# EAGLE schematic trig3_board_de0-nano_rack (EAGLE 9.6.2)
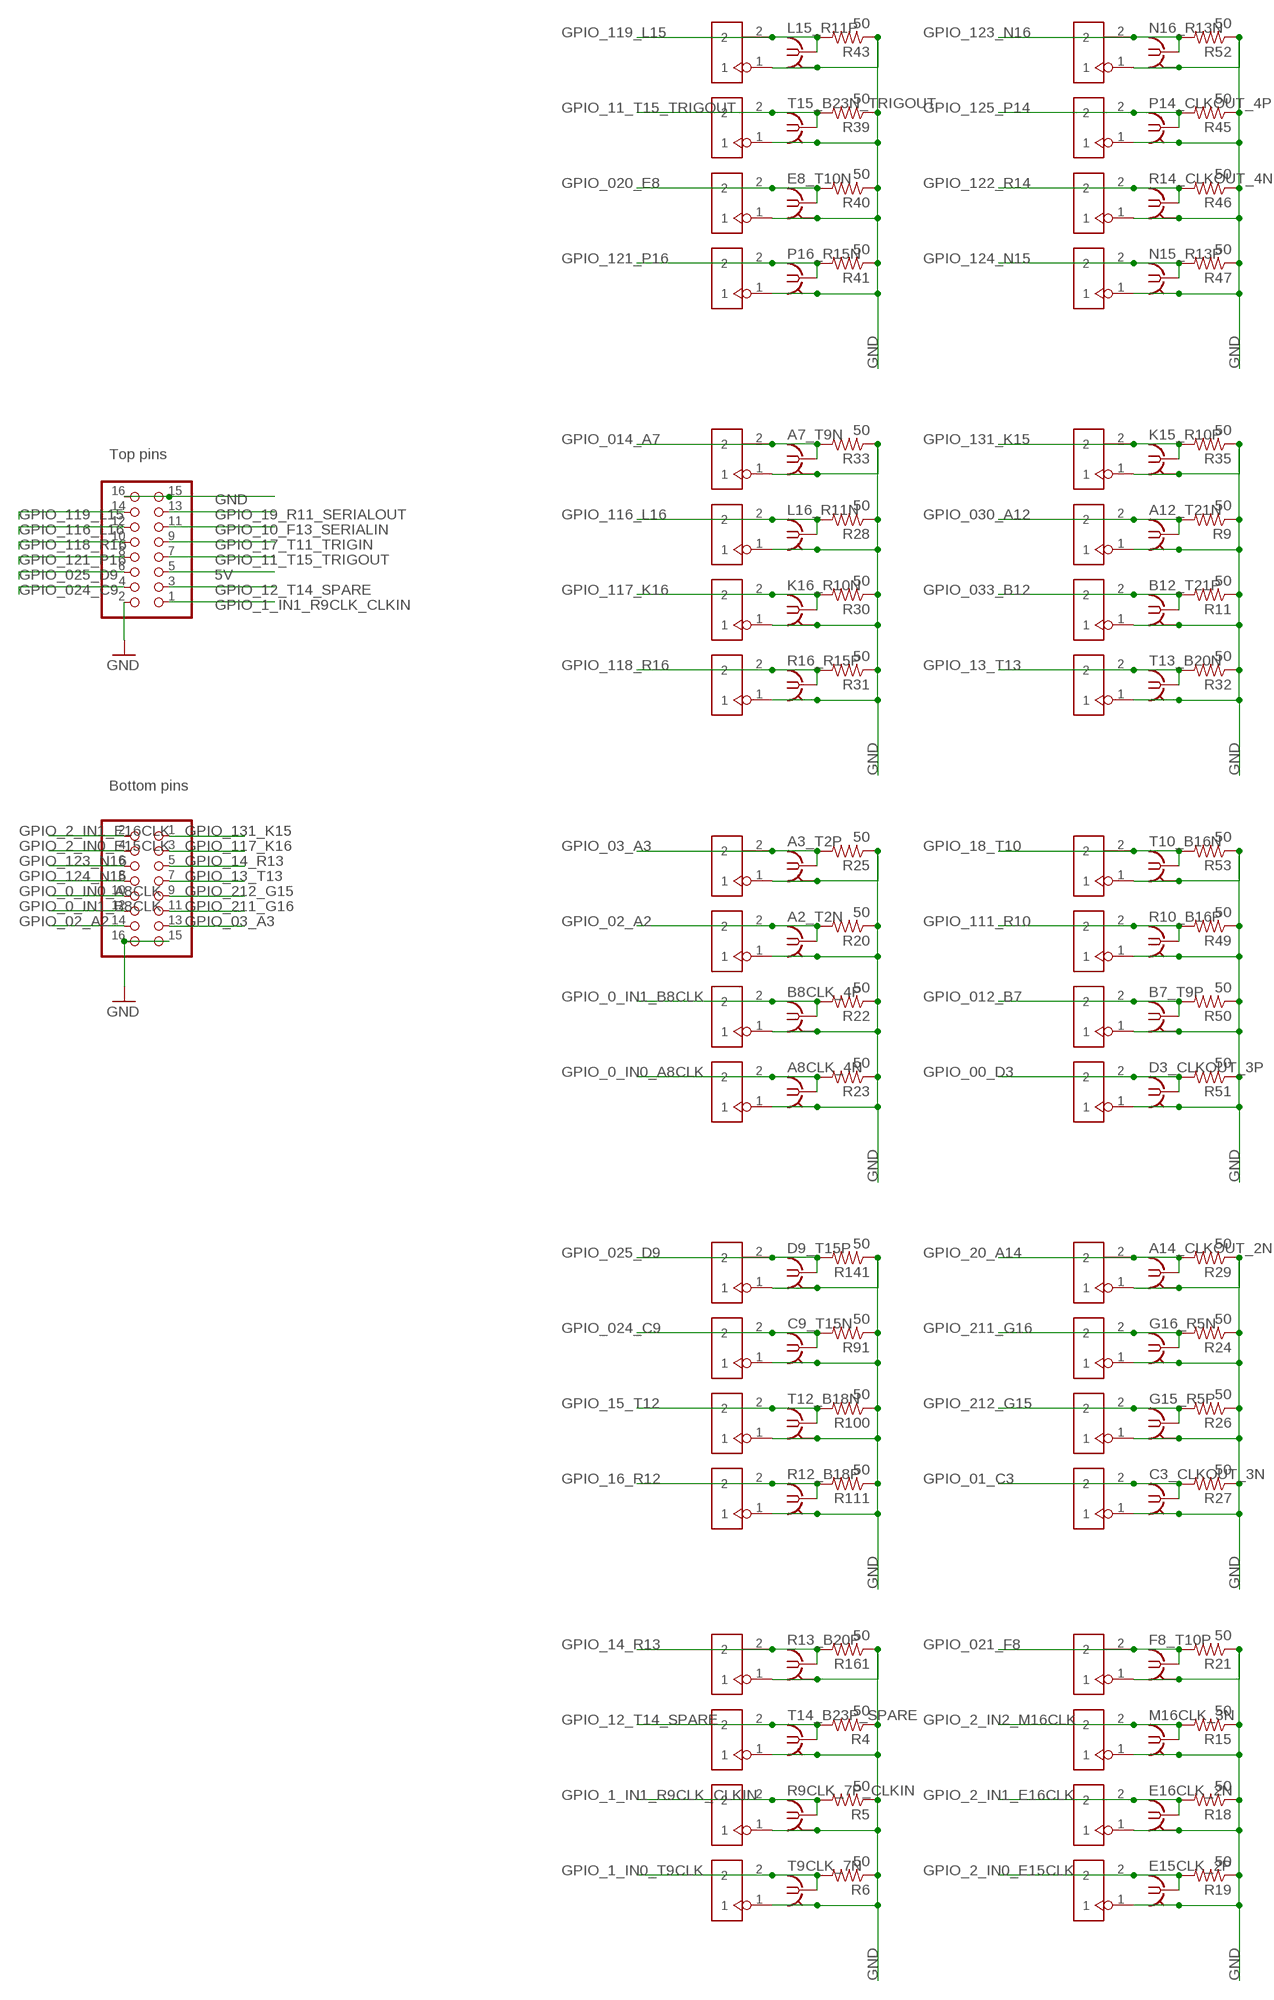
[diagram p0: schematic, sheet 1, part 1 of 3]
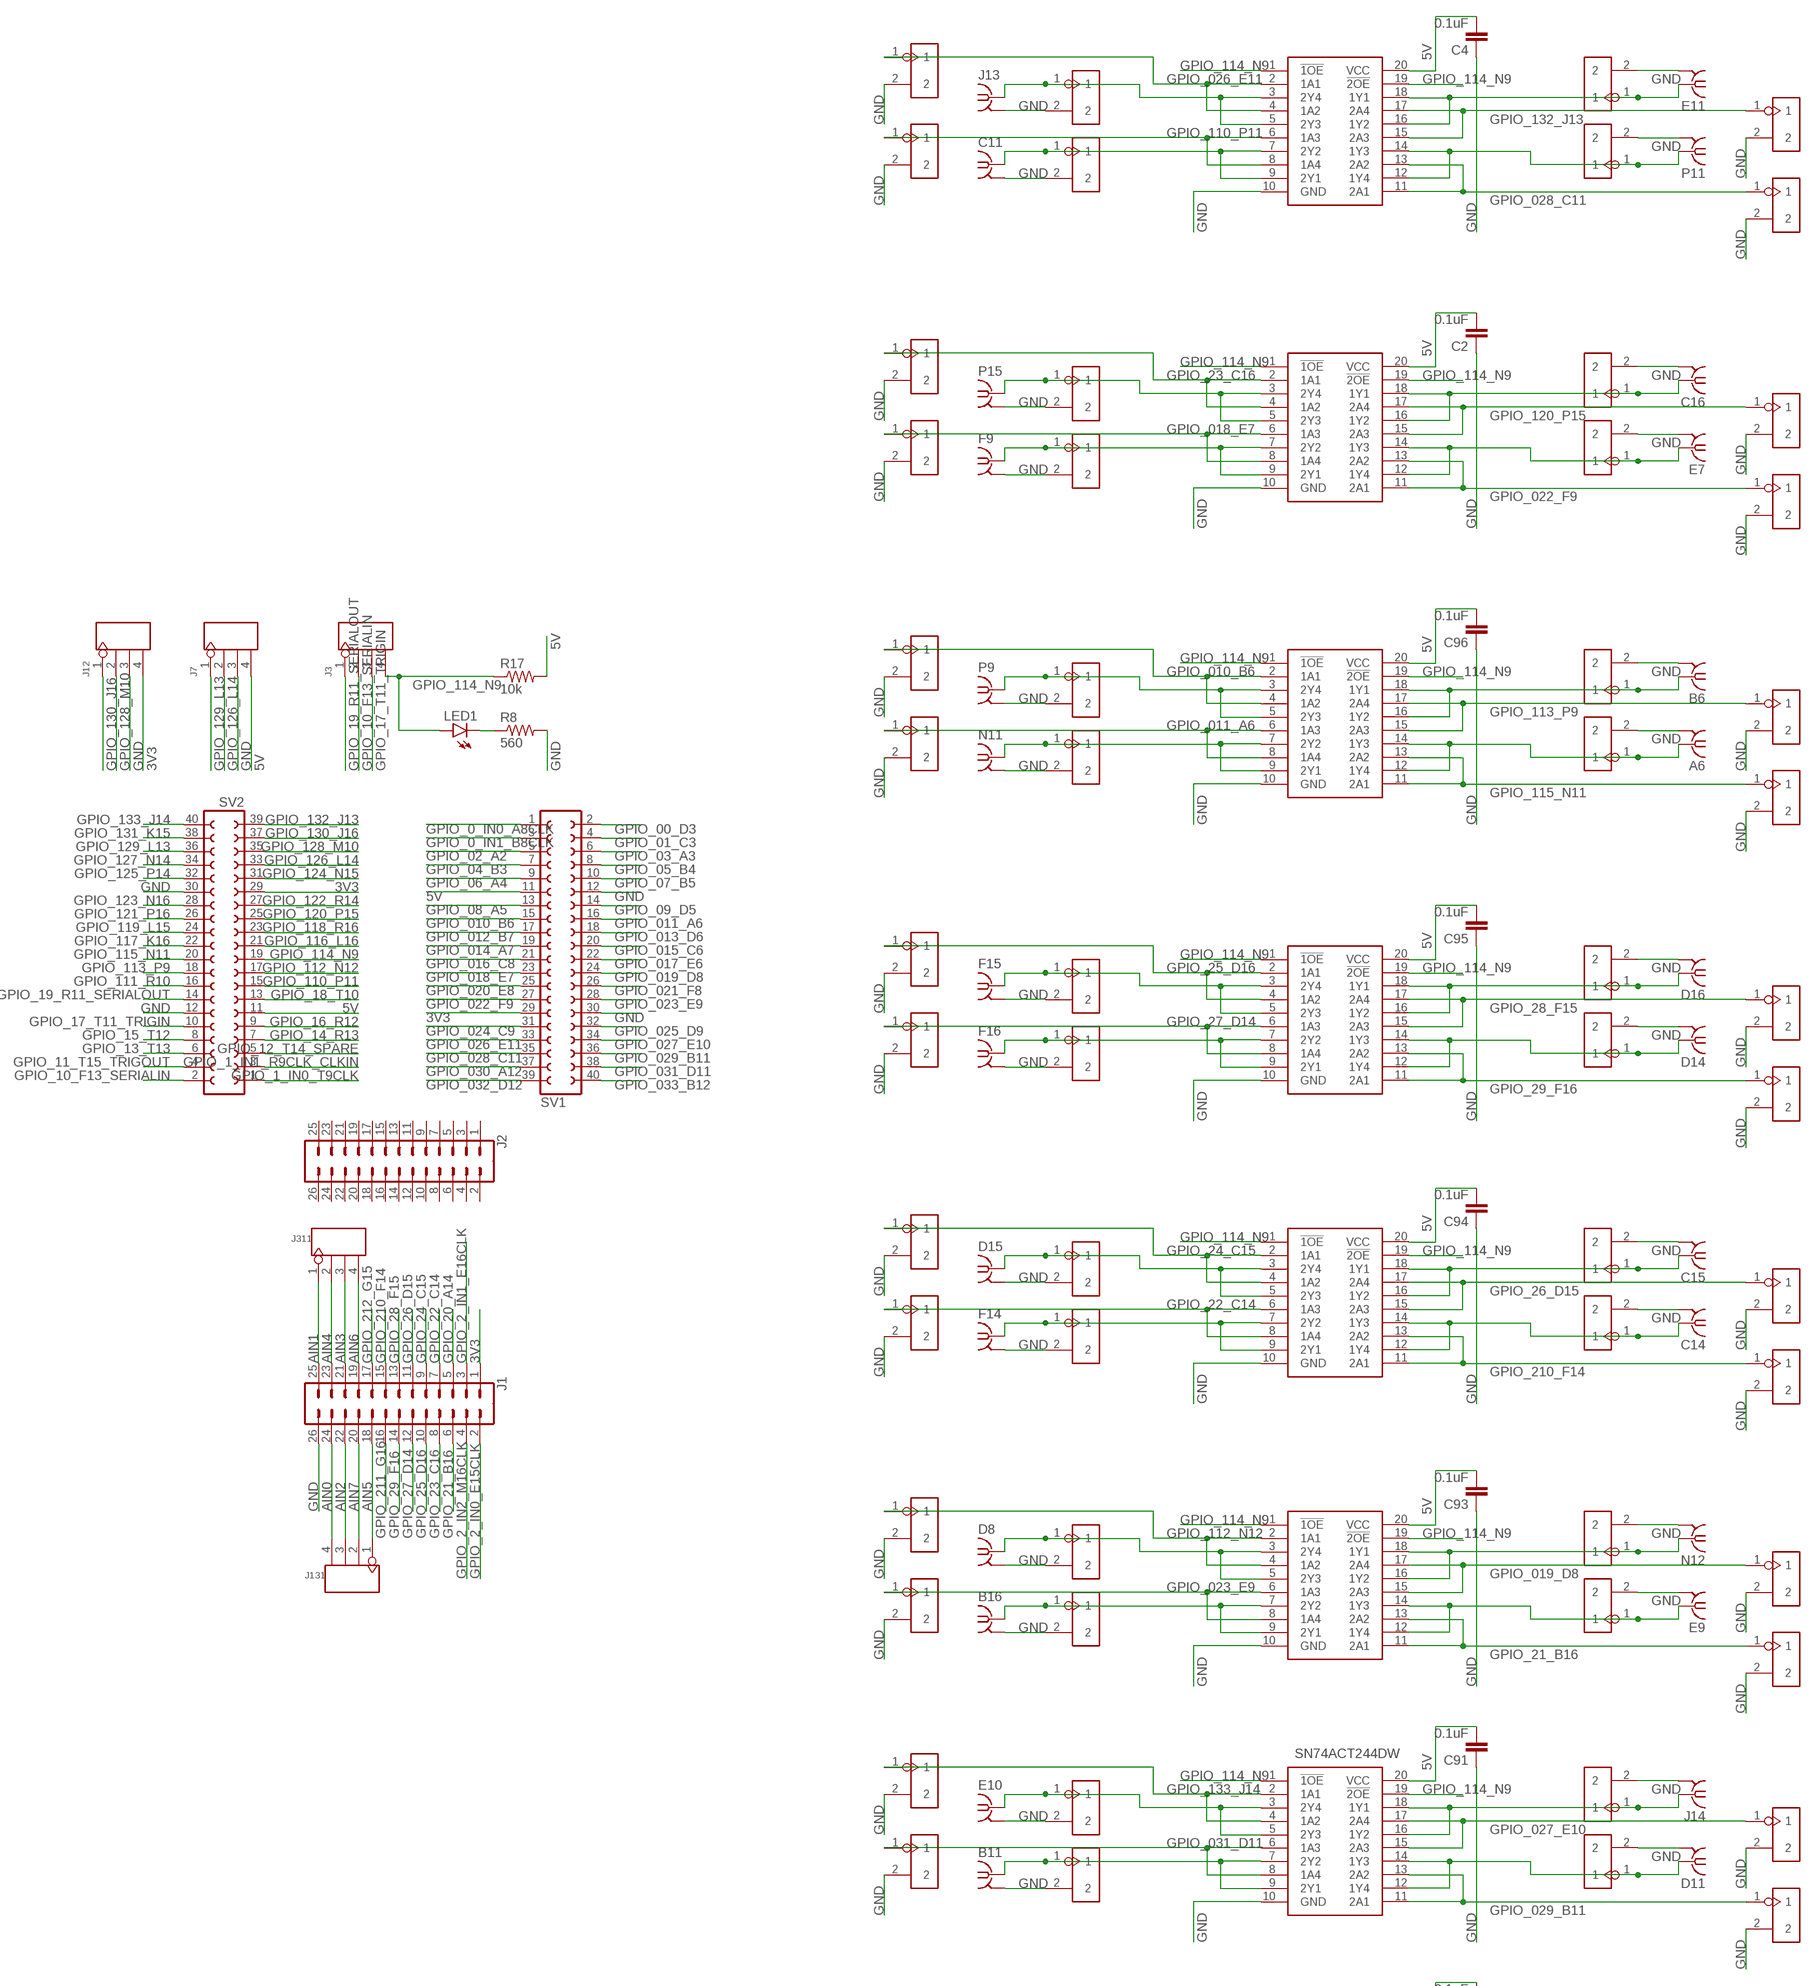
[diagram p1: schematic, sheet 1, part 2 of 3]
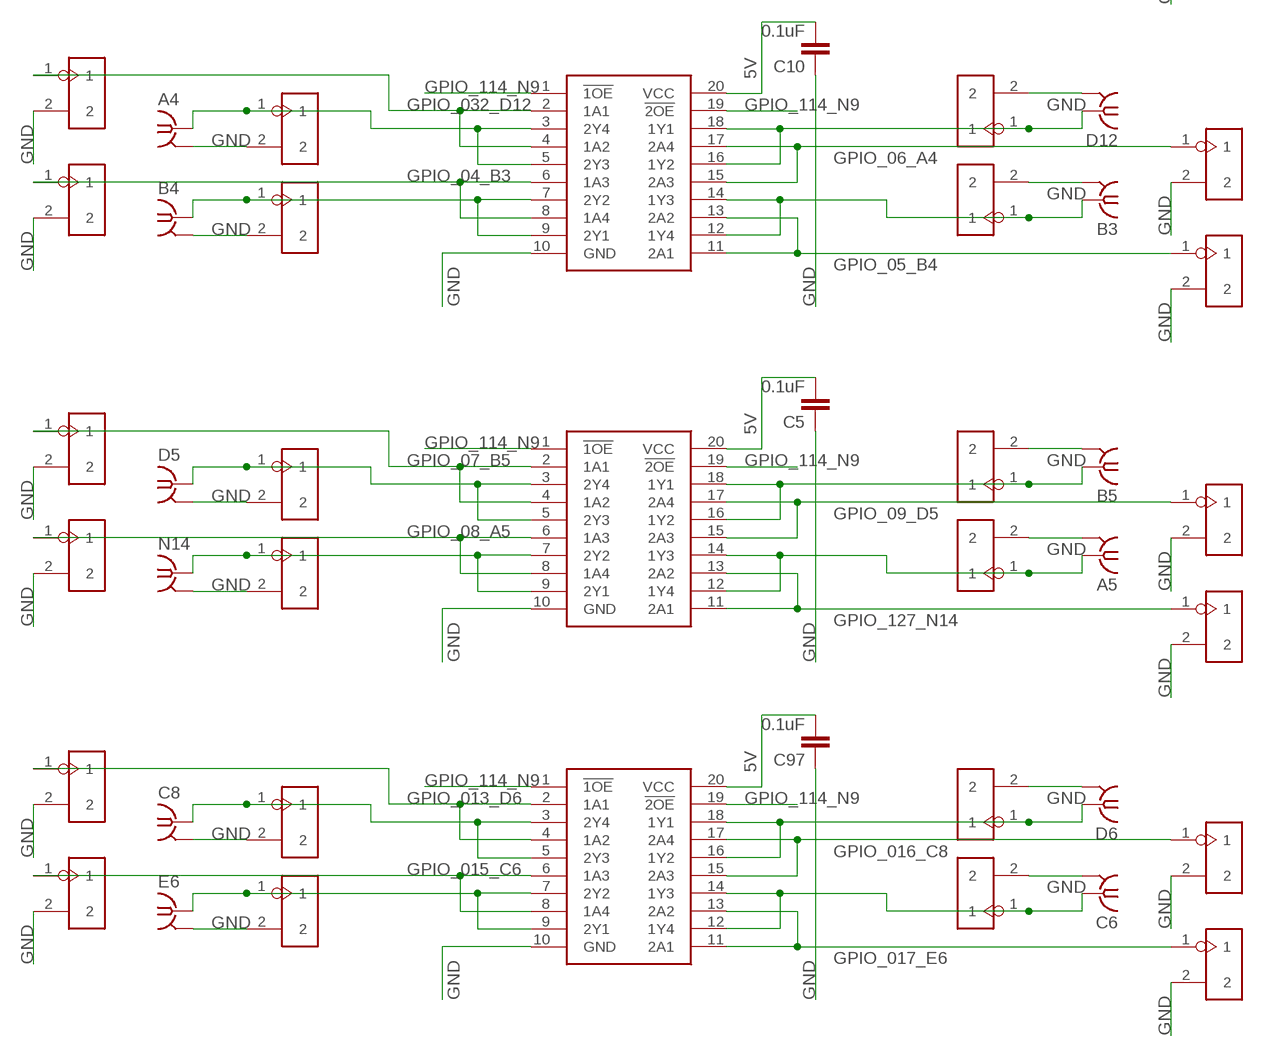
[diagram p2: schematic, sheet 1, part 3 of 3]

## Parts
A2_T2N  BU-SMB-V  [BU-SMB-V]
A3_T2P  BU-SMB-V  [BU-SMB-V]
A4  BU-SMB-V  [BU-SMB-V]
A5  BU-SMB-V  [BU-SMB-V]
A6  BU-SMB-V  [BU-SMB-V]
A7_T9N  BU-SMB-V  [BU-SMB-V]
A8CLK_4N  BU-SMB-V  [BU-SMB-V]
A12_T21N  BU-SMB-V  [BU-SMB-V]
A14_CLKOUT_2N  BU-SMB-V  [BU-SMB-V]
B3  BU-SMB-V  [BU-SMB-V]
B4  BU-SMB-V  [BU-SMB-V]
B5  BU-SMB-V  [BU-SMB-V]
B6  BU-SMB-V  [BU-SMB-V]
B7_T9P  BU-SMB-V  [BU-SMB-V]
B8CLK_4P  BU-SMB-V  [BU-SMB-V]
B11  BU-SMB-V  [BU-SMB-V]
B12_T21P  BU-SMB-V  [BU-SMB-V]
B16  BU-SMB-V  [BU-SMB-V]
C2  0.1uF  CAP0805  [0805]
C3_CLKOUT_3N  BU-SMB-V  [BU-SMB-V]
C4  0.1uF  CAP0805  [0805]
C5  0.1uF  CAP0805  [0805]
C6  BU-SMB-V  [BU-SMB-V]
C8  BU-SMB-V  [BU-SMB-V]
C9_T15N  BU-SMB-V  [BU-SMB-V]
C10  0.1uF  CAP0805  [0805]
C11  BU-SMB-V  [BU-SMB-V]
C14  BU-SMB-V  [BU-SMB-V]
C15  BU-SMB-V  [BU-SMB-V]
C16  BU-SMB-V  [BU-SMB-V]
C91  0.1uF  CAP0805  [0805]
C93  0.1uF  CAP0805  [0805]
C94  0.1uF  CAP0805  [0805]
C95  0.1uF  CAP0805  [0805]
C96  0.1uF  CAP0805  [0805]
C97  0.1uF  CAP0805  [0805]
D3_CLKOUT_3P  BU-SMB-V  [BU-SMB-V]
D5  BU-SMB-V  [BU-SMB-V]
D6  BU-SMB-V  [BU-SMB-V]
D8  BU-SMB-V  [BU-SMB-V]
D9_T15P  BU-SMB-V  [BU-SMB-V]
D11  BU-SMB-V  [BU-SMB-V]
D12  BU-SMB-V  [BU-SMB-V]
D14  BU-SMB-V  [BU-SMB-V]
D15  BU-SMB-V  [BU-SMB-V]
D16  BU-SMB-V  [BU-SMB-V]
E6  BU-SMB-V  [BU-SMB-V]
E7  BU-SMB-V  [BU-SMB-V]
E8_T10N  BU-SMB-V  [BU-SMB-V]
E9  BU-SMB-V  [BU-SMB-V]
E10  BU-SMB-V  [BU-SMB-V]
E11  BU-SMB-V  [BU-SMB-V]
E15CLK_2P  BU-SMB-V  [BU-SMB-V]
E16CLK_2N  BU-SMB-V  [BU-SMB-V]
F8_T10P  BU-SMB-V  [BU-SMB-V]
F9  BU-SMB-V  [BU-SMB-V]
F14  BU-SMB-V  [BU-SMB-V]
F15  BU-SMB-V  [BU-SMB-V]
F16  BU-SMB-V  [BU-SMB-V]
G15_R5P  BU-SMB-V  [BU-SMB-V]
G16_R5N  BU-SMB-V  [BU-SMB-V]
J1  M13X22X13  [2X13]
J2  M13X22X13  [2X13]
J3  4p-2.54  DIP-BLACK-FEMALE-HEADER-VERT(4P-2.54)  [H4-2.54]
J4  2p-2.54  DIP-BLACK-MALE-HEADER-VERT(2P-2.54)  [H2-2.54]
J5  2p-2.54  DIP-BLACK-MALE-HEADER-VERT(2P-2.54)  [H2-2.54]
J6  2p-2.54  DIP-BLACK-MALE-HEADER-VERT(2P-2.54)  [H2-2.54]
J7  4p-2.54  DIP-BLACK-FEMALE-HEADER-VERT(4P-2.54)  [H4-2.54]
J8  2p-2.54  DIP-BLACK-MALE-HEADER-VERT(2P-2.54)  [H2-2.54]
J9  2p-2.54  DIP-BLACK-MALE-HEADER-VERT(2P-2.54)  [H2-2.54]
J10  2p-2.54  DIP-BLACK-MALE-HEADER-VERT(2P-2.54)  [H2-2.54]
J11  2p-2.54  DIP-BLACK-MALE-HEADER-VERT(2P-2.54)  [H2-2.54]
J12  4p-2.54  DIP-BLACK-FEMALE-HEADER-VERT(4P-2.54)  [H4-2.54]
J13  BU-SMB-V  [BU-SMB-V]
J14  BU-SMB-V  [BU-SMB-V]
J15  2p-2.54  DIP-BLACK-MALE-HEADER-VERT(2P-2.54)  [H2-2.54]
J16  2p-2.54  DIP-BLACK-MALE-HEADER-VERT(2P-2.54)  [H2-2.54]
J17  2p-2.54  DIP-BLACK-MALE-HEADER-VERT(2P-2.54)  [H2-2.54]
J18  2p-2.54  DIP-BLACK-MALE-HEADER-VERT(2P-2.54)  [H2-2.54]
J22  2p-2.54  DIP-BLACK-MALE-HEADER-VERT(2P-2.54)  [H2-2.54]
J23  2p-2.54  DIP-BLACK-MALE-HEADER-VERT(2P-2.54)  [H2-2.54]
J24  2p-2.54  DIP-BLACK-MALE-HEADER-VERT(2P-2.54)  [H2-2.54]
J25  2p-2.54  DIP-BLACK-MALE-HEADER-VERT(2P-2.54)  [H2-2.54]
J28  2p-2.54  DIP-BLACK-MALE-HEADER-VERT(2P-2.54)  [H2-2.54]
J29  2p-2.54  DIP-BLACK-MALE-HEADER-VERT(2P-2.54)  [H2-2.54]
J30  2p-2.54  DIP-BLACK-MALE-HEADER-VERT(2P-2.54)  [H2-2.54]
J31  2p-2.54  DIP-BLACK-MALE-HEADER-VERT(2P-2.54)  [H2-2.54]
J32  2p-2.54  DIP-BLACK-MALE-HEADER-VERT(2P-2.54)  [H2-2.54]
J33  2p-2.54  DIP-BLACK-MALE-HEADER-VERT(2P-2.54)  [H2-2.54]
J34  2p-2.54  DIP-BLACK-MALE-HEADER-VERT(2P-2.54)  [H2-2.54]
J35  2p-2.54  DIP-BLACK-MALE-HEADER-VERT(2P-2.54)  [H2-2.54]
J36  2p-2.54  DIP-BLACK-MALE-HEADER-VERT(2P-2.54)  [H2-2.54]
J37  2p-2.54  DIP-BLACK-MALE-HEADER-VERT(2P-2.54)  [H2-2.54]
J38  2p-2.54  DIP-BLACK-MALE-HEADER-VERT(2P-2.54)  [H2-2.54]
J39  2p-2.54  DIP-BLACK-MALE-HEADER-VERT(2P-2.54)  [H2-2.54]
J40  2p-2.54  DIP-BLACK-MALE-HEADER-VERT(2P-2.54)  [H2-2.54]
J41  2p-2.54  DIP-BLACK-MALE-HEADER-VERT(2P-2.54)  [H2-2.54]
J42  2p-2.54  DIP-BLACK-MALE-HEADER-VERT(2P-2.54)  [H2-2.54]
J43  2p-2.54  DIP-BLACK-MALE-HEADER-VERT(2P-2.54)  [H2-2.54]
J48  2p-2.54  DIP-BLACK-MALE-HEADER-VERT(2P-2.54)  [H2-2.54]
J49  2p-2.54  DIP-BLACK-MALE-HEADER-VERT(2P-2.54)  [H2-2.54]
J50  2p-2.54  DIP-BLACK-MALE-HEADER-VERT(2P-2.54)  [H2-2.54]
J51  2p-2.54  DIP-BLACK-MALE-HEADER-VERT(2P-2.54)  [H2-2.54]
J52  2p-2.54  DIP-BLACK-MALE-HEADER-VERT(2P-2.54)  [H2-2.54]
J53  2p-2.54  DIP-BLACK-MALE-HEADER-VERT(2P-2.54)  [H2-2.54]
J54  2p-2.54  DIP-BLACK-MALE-HEADER-VERT(2P-2.54)  [H2-2.54]
J55  2p-2.54  DIP-BLACK-MALE-HEADER-VERT(2P-2.54)  [H2-2.54]
J131  4p-2.54  DIP-BLACK-FEMALE-HEADER-VERT(4P-2.54)  [H4-2.54]
J141  2p-2.54  DIP-BLACK-MALE-HEADER-VERT(2P-2.54)  [H2-2.54]
J311  4p-2.54  DIP-BLACK-FEMALE-HEADER-VERT(4P-2.54)  [H4-2.54]
K15_R10P  BU-SMB-V  [BU-SMB-V]
K16_R10N  BU-SMB-V  [BU-SMB-V]
L15_R11P  BU-SMB-V  [BU-SMB-V]
L16_R11N  BU-SMB-V  [BU-SMB-V]
LED1  red  LEDCHIP-LED0805  [CHIP-LED0805]
M16CLK_3N  BU-SMB-V  [BU-SMB-V]
N11  BU-SMB-V  [BU-SMB-V]
N12  BU-SMB-V  [BU-SMB-V]
N14  BU-SMB-V  [BU-SMB-V]
N15_R13P  BU-SMB-V  [BU-SMB-V]
N16_R13N  BU-SMB-V  [BU-SMB-V]
OJ1  2p-2.54  DIP-BLACK-MALE-HEADER-VERT(2P-2.54)  [H2-2.54]
OJ2  2p-2.54  DIP-BLACK-MALE-HEADER-VERT(2P-2.54)  [H2-2.54]
OJ3  2p-2.54  DIP-BLACK-MALE-HEADER-VERT(2P-2.54)  [H2-2.54]
OJ4  2p-2.54  DIP-BLACK-MALE-HEADER-VERT(2P-2.54)  [H2-2.54]
OJ5  2p-2.54  DIP-BLACK-MALE-HEADER-VERT(2P-2.54)  [H2-2.54]
OJ6  2p-2.54  DIP-BLACK-MALE-HEADER-VERT(2P-2.54)  [H2-2.54]
OJ7  2p-2.54  DIP-BLACK-MALE-HEADER-VERT(2P-2.54)  [H2-2.54]
OJ8  2p-2.54  DIP-BLACK-MALE-HEADER-VERT(2P-2.54)  [H2-2.54]
OJ17  2p-2.54  DIP-BLACK-MALE-HEADER-VERT(2P-2.54)  [H2-2.54]
OJ18  2p-2.54  DIP-BLACK-MALE-HEADER-VERT(2P-2.54)  [H2-2.54]
OJ19  2p-2.54  DIP-BLACK-MALE-HEADER-VERT(2P-2.54)  [H2-2.54]
OJ20  2p-2.54  DIP-BLACK-MALE-HEADER-VERT(2P-2.54)  [H2-2.54]
OJ21  2p-2.54  DIP-BLACK-MALE-HEADER-VERT(2P-2.54)  [H2-2.54]
OJ22  2p-2.54  DIP-BLACK-MALE-HEADER-VERT(2P-2.54)  [H2-2.54]
OJ23  2p-2.54  DIP-BLACK-MALE-HEADER-VERT(2P-2.54)  [H2-2.54]
OJ24  2p-2.54  DIP-BLACK-MALE-HEADER-VERT(2P-2.54)  [H2-2.54]
OJ25  2p-2.54  DIP-BLACK-MALE-HEADER-VERT(2P-2.54)  [H2-2.54]
OJ26  2p-2.54  DIP-BLACK-MALE-HEADER-VERT(2P-2.54)  [H2-2.54]
OJ27  2p-2.54  DIP-BLACK-MALE-HEADER-VERT(2P-2.54)  [H2-2.54]
OJ28  2p-2.54  DIP-BLACK-MALE-HEADER-VERT(2P-2.54)  [H2-2.54]
OJ29  2p-2.54  DIP-BLACK-MALE-HEADER-VERT(2P-2.54)  [H2-2.54]
OJ30  2p-2.54  DIP-BLACK-MALE-HEADER-VERT(2P-2.54)  [H2-2.54]
OJ31  2p-2.54  DIP-BLACK-MALE-HEADER-VERT(2P-2.54)  [H2-2.54]
OJ32  2p-2.54  DIP-BLACK-MALE-HEADER-VERT(2P-2.54)  [H2-2.54]
OJ33  2p-2.54  DIP-BLACK-MALE-HEADER-VERT(2P-2.54)  [H2-2.54]
OJ34  2p-2.54  DIP-BLACK-MALE-HEADER-VERT(2P-2.54)  [H2-2.54]
OJ35  2p-2.54  DIP-BLACK-MALE-HEADER-VERT(2P-2.54)  [H2-2.54]
OJ36  2p-2.54  DIP-BLACK-MALE-HEADER-VERT(2P-2.54)  [H2-2.54]
OJ37  2p-2.54  DIP-BLACK-MALE-HEADER-VERT(2P-2.54)  [H2-2.54]
OJ38  2p-2.54  DIP-BLACK-MALE-HEADER-VERT(2P-2.54)  [H2-2.54]
OJ39  2p-2.54  DIP-BLACK-MALE-HEADER-VERT(2P-2.54)  [H2-2.54]
OJ40  2p-2.54  DIP-BLACK-MALE-HEADER-VERT(2P-2.54)  [H2-2.54]
OJ41  2p-2.54  DIP-BLACK-MALE-HEADER-VERT(2P-2.54)  [H2-2.54]
OJ42  2p-2.54  DIP-BLACK-MALE-HEADER-VERT(2P-2.54)  [H2-2.54]
OJ43  2p-2.54  DIP-BLACK-MALE-HEADER-VERT(2P-2.54)  [H2-2.54]
OJ44  2p-2.54  DIP-BLACK-MALE-HEADER-VERT(2P-2.54)  [H2-2.54]
OJ45  2p-2.54  DIP-BLACK-MALE-HEADER-VERT(2P-2.54)  [H2-2.54]
OJ46  2p-2.54  DIP-BLACK-MALE-HEADER-VERT(2P-2.54)  [H2-2.54]
OJ47  2p-2.54  DIP-BLACK-MALE-HEADER-VERT(2P-2.54)  [H2-2.54]
OJ48  2p-2.54  DIP-BLACK-MALE-HEADER-VERT(2P-2.54)  [H2-2.54]
OJ49  2p-2.54  DIP-BLACK-MALE-HEADER-VERT(2P-2.54)  [H2-2.54]
OJ50  2p-2.54  DIP-BLACK-MALE-HEADER-VERT(2P-2.54)  [H2-2.54]
OJ51  2p-2.54  DIP-BLACK-MALE-HEADER-VERT(2P-2.54)  [H2-2.54]
OJ52  2p-2.54  DIP-BLACK-MALE-HEADER-VERT(2P-2.54)  [H2-2.54]
OJ53  2p-2.54  DIP-BLACK-MALE-HEADER-VERT(2P-2.54)  [H2-2.54]
OJ54  2p-2.54  DIP-BLACK-MALE-HEADER-VERT(2P-2.54)  [H2-2.54]
OJ55  2p-2.54  DIP-BLACK-MALE-HEADER-VERT(2P-2.54)  [H2-2.54]
OJ56  2p-2.54  DIP-BLACK-MALE-HEADER-VERT(2P-2.54)  [H2-2.54]
OJ57  2p-2.54  DIP-BLACK-MALE-HEADER-VERT(2P-2.54)  [H2-2.54]
OJ58  2p-2.54  DIP-BLACK-MALE-HEADER-VERT(2P-2.54)  [H2-2.54]
OJ59  2p-2.54  DIP-BLACK-MALE-HEADER-VERT(2P-2.54)  [H2-2.54]
OJ60  2p-2.54  DIP-BLACK-MALE-HEADER-VERT(2P-2.54)  [H2-2.54]
OJ61  2p-2.54  DIP-BLACK-MALE-HEADER-VERT(2P-2.54)  [H2-2.54]
OJ62  2p-2.54  DIP-BLACK-MALE-HEADER-VERT(2P-2.54)  [H2-2.54]
OJ63  2p-2.54  DIP-BLACK-MALE-HEADER-VERT(2P-2.54)  [H2-2.54]
OJ64  2p-2.54  DIP-BLACK-MALE-HEADER-VERT(2P-2.54)  [H2-2.54]
OJ65  2p-2.54  DIP-BLACK-MALE-HEADER-VERT(2P-2.54)  [H2-2.54]
OJ66  2p-2.54  DIP-BLACK-MALE-HEADER-VERT(2P-2.54)  [H2-2.54]
OJ67  2p-2.54  DIP-BLACK-MALE-HEADER-VERT(2P-2.54)  [H2-2.54]
OJ68  2p-2.54  DIP-BLACK-MALE-HEADER-VERT(2P-2.54)  [H2-2.54]
OJ69  2p-2.54  DIP-BLACK-MALE-HEADER-VERT(2P-2.54)  [H2-2.54]
OJ70  2p-2.54  DIP-BLACK-MALE-HEADER-VERT(2P-2.54)  [H2-2.54]
OJ71  2p-2.54  DIP-BLACK-MALE-HEADER-VERT(2P-2.54)  [H2-2.54]
OJ72  2p-2.54  DIP-BLACK-MALE-HEADER-VERT(2P-2.54)  [H2-2.54]
OJ73  2p-2.54  DIP-BLACK-MALE-HEADER-VERT(2P-2.54)  [H2-2.54]
OJ74  2p-2.54  DIP-BLACK-MALE-HEADER-VERT(2P-2.54)  [H2-2.54]
OJ75  2p-2.54  DIP-BLACK-MALE-HEADER-VERT(2P-2.54)  [H2-2.54]
OJ76  2p-2.54  DIP-BLACK-MALE-HEADER-VERT(2P-2.54)  [H2-2.54]
OJ77  2p-2.54  DIP-BLACK-MALE-HEADER-VERT(2P-2.54)  [H2-2.54]
OJ78  2p-2.54  DIP-BLACK-MALE-HEADER-VERT(2P-2.54)  [H2-2.54]
OJ79  2p-2.54  DIP-BLACK-MALE-HEADER-VERT(2P-2.54)  [H2-2.54]
OJ80  2p-2.54  DIP-BLACK-MALE-HEADER-VERT(2P-2.54)  [H2-2.54]
OJ89  2p-2.54  DIP-BLACK-MALE-HEADER-VERT(2P-2.54)  [H2-2.54]
OJ90  2p-2.54  DIP-BLACK-MALE-HEADER-VERT(2P-2.54)  [H2-2.54]
OJ91  2p-2.54  DIP-BLACK-MALE-HEADER-VERT(2P-2.54)  [H2-2.54]
OJ92  2p-2.54  DIP-BLACK-MALE-HEADER-VERT(2P-2.54)  [H2-2.54]
OJ93  2p-2.54  DIP-BLACK-MALE-HEADER-VERT(2P-2.54)  [H2-2.54]
OJ94  2p-2.54  DIP-BLACK-MALE-HEADER-VERT(2P-2.54)  [H2-2.54]
OJ95  2p-2.54  DIP-BLACK-MALE-HEADER-VERT(2P-2.54)  [H2-2.54]
OJ96  2p-2.54  DIP-BLACK-MALE-HEADER-VERT(2P-2.54)  [H2-2.54]
P9  BU-SMB-V  [BU-SMB-V]
P11  BU-SMB-V  [BU-SMB-V]
P14_CLKOUT_4P  BU-SMB-V  [BU-SMB-V]
P15  BU-SMB-V  [BU-SMB-V]
P16_R15N  BU-SMB-V  [BU-SMB-V]
PIN_AIN_PWRGND21  15-91-2160  PINHD-2X8/90  [2X08/90]
PIN_ANALOG_21  15-91-2160  PINHD-2X8/90  [2X08/90]
R4  50  RESISTORAXIAL-0.3  [AXIAL-0.3]
R5  50  RESISTORAXIAL-0.3  [AXIAL-0.3]
R6  50  RESISTORAXIAL-0.3  [AXIAL-0.3]
R8  560  R-US_R0805  [R0805]
R9  50  RESISTORAXIAL-0.3  [AXIAL-0.3]
R9CLK_7P_CLKIN  BU-SMB-V  [BU-SMB-V]
R10_B16P  BU-SMB-V  [BU-SMB-V]
R11  50  RESISTORAXIAL-0.3  [AXIAL-0.3]
R12_B18P  BU-SMB-V  [BU-SMB-V]
R13_B20P  BU-SMB-V  [BU-SMB-V]
R14_CLKOUT_4N  BU-SMB-V  [BU-SMB-V]
R15  50  RESISTORAXIAL-0.3  [AXIAL-0.3]
R16_R15P  BU-SMB-V  [BU-SMB-V]
R17  10k  R-US_R0805  [R0805]
R18  50  RESISTORAXIAL-0.3  [AXIAL-0.3]
R19  50  RESISTORAXIAL-0.3  [AXIAL-0.3]
R20  50  RESISTORAXIAL-0.3  [AXIAL-0.3]
R21  50  RESISTORAXIAL-0.3  [AXIAL-0.3]
R22  50  RESISTORAXIAL-0.3  [AXIAL-0.3]
R23  50  RESISTORAXIAL-0.3  [AXIAL-0.3]
R24  50  RESISTORAXIAL-0.3  [AXIAL-0.3]
R25  50  RESISTORAXIAL-0.3  [AXIAL-0.3]
R26  50  RESISTORAXIAL-0.3  [AXIAL-0.3]
R27  50  RESISTORAXIAL-0.3  [AXIAL-0.3]
R28  50  RESISTORAXIAL-0.3  [AXIAL-0.3]
R29  50  RESISTORAXIAL-0.3  [AXIAL-0.3]
R30  50  RESISTORAXIAL-0.3  [AXIAL-0.3]
R31  50  RESISTORAXIAL-0.3  [AXIAL-0.3]
R32  50  RESISTORAXIAL-0.3  [AXIAL-0.3]
R33  50  RESISTORAXIAL-0.3  [AXIAL-0.3]
R35  50  RESISTORAXIAL-0.3  [AXIAL-0.3]
R39  50  RESISTORAXIAL-0.3  [AXIAL-0.3]
R40  50  RESISTORAXIAL-0.3  [AXIAL-0.3]
R41  50  RESISTORAXIAL-0.3  [AXIAL-0.3]
R43  50  RESISTORAXIAL-0.3  [AXIAL-0.3]
R45  50  RESISTORAXIAL-0.3  [AXIAL-0.3]
R46  50  RESISTORAXIAL-0.3  [AXIAL-0.3]
R47  50  RESISTORAXIAL-0.3  [AXIAL-0.3]
R49  50  RESISTORAXIAL-0.3  [AXIAL-0.3]
R50  50  RESISTORAXIAL-0.3  [AXIAL-0.3]
R51  50  RESISTORAXIAL-0.3  [AXIAL-0.3]
R52  50  RESISTORAXIAL-0.3  [AXIAL-0.3]
R53  50  RESISTORAXIAL-0.3  [AXIAL-0.3]
R91  50  RESISTORAXIAL-0.3  [AXIAL-0.3]
R100  50  RESISTORAXIAL-0.3  [AXIAL-0.3]
R111  50  RESISTORAXIAL-0.3  [AXIAL-0.3]
R141  50  RESISTORAXIAL-0.3  [AXIAL-0.3]
R161  50  RESISTORAXIAL-0.3  [AXIAL-0.3]
SV1  FE20-2  [FE20-2]
SV2  FE20-2  [FE20-2]
T9CLK_7N  BU-SMB-V  [BU-SMB-V]
T10_B16N  BU-SMB-V  [BU-SMB-V]
T12_B18N  BU-SMB-V  [BU-SMB-V]
T13_B20N  BU-SMB-V  [BU-SMB-V]
T14_B23P_SPARE  BU-SMB-V  [BU-SMB-V]
T15_B23N_TRIGOUT  BU-SMB-V  [BU-SMB-V]
VSLUE  SN74ACT244DW  [SOIC127P1030X265-20N]
VSLUE2  SN74ACT244DW  [SOIC127P1030X265-20N]
VSLUE3  SN74ACT244DW  [SOIC127P1030X265-20N]
VSLUE4  SN74ACT244DW  [SOIC127P1030X265-20N]
VSLUE5  SN74ACT244DW  [SOIC127P1030X265-20N]
VSLUE6  SN74ACT244DW  [SOIC127P1030X265-20N]
VSLUE7  SN74ACT244DW  [SOIC127P1030X265-20N]
VSLUE8  SN74ACT244DW  [SOIC127P1030X265-20N]
VSLUE9  SN74ACT244DW  [SOIC127P1030X265-20N]
VSLUE11  SN74ACT244DW  [SOIC127P1030X265-20N]

## Nets
3V3 [power]: J1.1 J12.4 SV1.29 SV2.29
5V [power]: C2.2 C4.2 C5.2 C10.2 C91.2 C93.2 C94.2 C95.2 C96.2 C97.2 J7.4 PIN_ANALOG_21.5 R17.2 SV1.11 SV2.11 VSLUE2.20(VCC) VSLUE3.20(VCC) VSLUE4.20(VCC) VSLUE5.20(VCC) VSLUE6.20(VCC) VSLUE7.20(VCC) VSLUE8.20(VCC) VSLUE9.20(VCC) VSLUE11.20(VCC) VSLUE.20(VCC)
AIN0 [50ohm]: J1.24 J131.4
AIN1 [50ohm]: J1.25 J311.1
AIN2 [50ohm]: J1.22 J131.3
AIN3 [50ohm]: J1.21 J311.3
AIN4 [50ohm]: J1.23 J311.2
AIN5 [50ohm]: J1.18 J131.1
AIN6 [50ohm]: J1.19 J311.4
AIN7 [50ohm]: J1.20 J131.2
GND [power]: A2_T2N.2 A2_T2N.3 A2_T2N.4 A2_T2N.5 A3_T2P.2 A3_T2P.3 A3_T2P.4 A3_T2P.5 A4.2 A4.3 A4.4 A4.5 A5.2 A5.3 A5.4 A5.5 A6.2 A6.3 A6.4 A6.5 A7_T9N.2 A7_T9N.3 A7_T9N.4 A7_T9N.5 A8CLK_4N.2 A8CLK_4N.3 A8CLK_4N.4 A8CLK_4N.5 A12_T21N.2 A12_T21N.3 A12_T21N.4 A12_T21N.5 A14_CLKOUT_2N.2 A14_CLKOUT_2N.3 A14_CLKOUT_2N.4 A14_CLKOUT_2N.5 B3.2 B3.3 B3.4 B3.5 B4.2 B4.3 B4.4 B4.5 B5.2 B5.3 B5.4 B5.5 B6.2 B6.3 B6.4 B6.5 B7_T9P.2 B7_T9P.3 B7_T9P.4 B7_T9P.5 B8CLK_4P.2 B8CLK_4P.3 B8CLK_4P.4 B8CLK_4P.5 B11.2 B11.3 B11.4 B11.5 B12_T21P.2 B12_T21P.3 B12_T21P.4 B12_T21P.5 B16.2 B16.3 B16.4 B16.5 C2.1 C3_CLKOUT_3N.2 C3_CLKOUT_3N.3 C3_CLKOUT_3N.4 C3_CLKOUT_3N.5 C4.1 C5.1 C6.2 C6.3 C6.4 C6.5 C8.2 C8.3 C8.4 C8.5 C9_T15N.2 C9_T15N.3 C9_T15N.4 C9_T15N.5 C10.1 C11.2 C11.3 C11.4 C11.5 C14.2 C14.3 C14.4 C14.5 C15.2 C15.3 C15.4 C15.5 C16.2 C16.3 C16.4 C16.5 C91.1 C93.1 C94.1 C95.1 C96.1 C97.1 D3_CLKOUT_3P.2 D3_CLKOUT_3P.3 D3_CLKOUT_3P.4 D3_CLKOUT_3P.5 D5.2 D5.3 D5.4 D5.5 D6.2 D6.3 D6.4 D6.5 D8.2 D8.3 D8.4 D8.5 D9_T15P.2 D9_T15P.3 D9_T15P.4 D9_T15P.5 D11.2 D11.3 D11.4 D11.5 D12.2 D12.3 D12.4 D12.5 D14.2 D14.3 D14.4 D14.5 D15.2 D15.3 D15.4 D15.5 D16.2 D16.3 D16.4 D16.5 E6.2 E6.3 E6.4 E6.5 E7.2 E7.3 E7.4 E7.5 E8_T10N.2 E8_T10N.3 E8_T10N.4 E8_T10N.5 E9.2 E9.3 E9.4 E9.5 E10.2 E10.3 E10.4 E10.5 E11.2 E11.3 E11.4 E11.5 E15CLK_2P.2 E15CLK_2P.3 E15CLK_2P.4 E15CLK_2P.5 E16CLK_2N.2 E16CLK_2N.3 E16CLK_2N.4 E16CLK_2N.5 F8_T10P.2 F8_T10P.3 F8_T10P.4 F8_T10P.5 F9.2 F9.3 F9.4 F9.5 F14.2 F14.3 F14.4 F14.5 F15.2 F15.3 F15.4 F15.5 F16.2 F16.3 F16.4 F16.5 G15_R5P.2 G15_R5P.3 G15_R5P.4 G15_R5P.5 G16_R5N.2 G16_R5N.3 G16_R5N.4 G16_R5N.5 J1.26 J4.1 J5.1 J6.1 J7.3 J8.1 J9.1 J10.1 J11.1 J12.3 J13.2 J13.3 J13.4 J13.5 J14.2 J14.3 J14.4 J14.5 J15.1 J16.1 J17.1 J18.1 J22.1 J23.1 J24.1 J25.1 J28.1 J29.1 J30.1 J31.1 J32.1 J33.1 J34.1 J35.1 J36.1 J37.1 J38.1 J39.1 J40.1 J41.1 J42.1 J43.1 J48.1 J49.1 J50.1 J51.1 J52.1 J53.1 J54.1 J55.1 J141.1 K15_R10P.2 K15_R10P.3 K15_R10P.4 K15_R10P.5 K16_R10N.2 K16_R10N.3 K16_R10N.4 K16_R10N.5 L15_R11P.2 L15_R11P.3 L15_R11P.4 L15_R11P.5 L16_R11N.2 L16_R11N.3 L16_R11N.4 L16_R11N.5 M16CLK_3N.2 M16CLK_3N.3 M16CLK_3N.4 M16CLK_3N.5 N11.2 N11.3 N11.4 N11.5 N12.2 N12.3 N12.4 N12.5 N14.2 N14.3 N14.4 N14.5 N15_R13P.2 N15_R13P.3 N15_R13P.4 N15_R13P.5 N16_R13N.2 N16_R13N.3 N16_R13N.4 N16_R13N.5 OJ1.2 OJ2.2 OJ3.2 OJ4.2 OJ5.2 OJ6.2 OJ7.2 OJ8.2 OJ17.2 OJ18.2 OJ19.2 OJ20.2 OJ21.2 OJ22.2 OJ23.2 OJ24.2 OJ25.2 OJ26.2 OJ27.2 OJ28.2 OJ29.2 OJ30.2 OJ31.2 OJ32.2 OJ33.2 OJ34.2 OJ35.2 OJ36.2 OJ37.2 OJ38.2 OJ39.2 OJ40.2 OJ41.2 OJ42.2 OJ43.2 OJ44.2 OJ45.2 OJ46.2 OJ47.2 OJ48.2 OJ49.2 OJ50.2 OJ51.2 OJ52.2 OJ53.2 OJ54.2 OJ55.2 OJ56.2 OJ57.2 OJ58.2 OJ59.2 OJ60.2 OJ61.2 OJ62.2 OJ63.2 OJ64.2 OJ65.2 OJ66.2 OJ67.2 OJ68.2 OJ69.2 OJ70.2 OJ71.2 OJ72.2 OJ73.2 OJ74.2 OJ75.2 OJ76.2 OJ77.2 OJ78.2 OJ79.2 OJ80.2 OJ89.2 OJ90.2 OJ91.2 OJ92.2 OJ93.2 OJ94.2 OJ95.2 OJ96.2 P9.2 P9.3 P9.4 P9.5 P11.2 P11.3 P11.4 P11.5 P14_CLKOUT_4P.2 P14_CLKOUT_4P.3 P14_CLKOUT_4P.4 P14_CLKOUT_4P.5 P15.2 P15.3 P15.4 P15.5 P16_R15N.2 P16_R15N.3 P16_R15N.4 P16_R15N.5 PIN_AIN_PWRGND21.15 PIN_AIN_PWRGND21.16 PIN_ANALOG_21.2 PIN_ANALOG_21.15 PIN_ANALOG_21.16 R4.P$1 R5.P$1 R6.P$1 R8.2 R9.P$1 R9CLK_7P_CLKIN.2 R9CLK_7P_CLKIN.3 R9CLK_7P_CLKIN.4 R9CLK_7P_CLKIN.5 R10_B16P.2 R10_B16P.3 R10_B16P.4 R10_B16P.5 R11.P$1 R12_B18P.2 R12_B18P.3 R12_B18P.4 R12_B18P.5 R13_B20P.2 R13_B20P.3 R13_B20P.4 R13_B20P.5 R14_CLKOUT_4N.2 R14_CLKOUT_4N.3 R14_CLKOUT_4N.4 R14_CLKOUT_4N.5 R15.P$1 R16_R15P.2 R16_R15P.3 R16_R15P.4 R16_R15P.5 R18.P$1 R19.P$1 R20.P$1 R21.P$1 R22.P$1 R23.P$1 R24.P$1 R25.P$1 R26.P$1 R27.P$1 R28.P$1 R29.P$1 R30.P$1 R31.P$1 R32.P$1 R33.P$1 R35.P$1 R39.P$1 R40.P$1 R41.P$1 R43.P$1 R45.P$1 R46.P$1 R47.P$1 R49.P$1 R50.P$1 R51.P$1 R52.P$1 R53.P$1 R91.P$1 R100.P$1 R111.P$1 R141.P$1 R161.P$1 SV1.12 SV1.30 SV2.12 SV2.30 T9CLK_7N.2 T9CLK_7N.3 T9CLK_7N.4 T9CLK_7N.5 T10_B16N.2 T10_B16N.3 T10_B16N.4 T10_B16N.5 T12_B18N.2 T12_B18N.3 T12_B18N.4 T12_B18N.5 T13_B20N.2 T13_B20N.3 T13_B20N.4 T13_B20N.5 T14_B23P_SPARE.2 T14_B23P_SPARE.3 T14_B23P_SPARE.4 T14_B23P_SPARE.5 T15_B23N_TRIGOUT.2 T15_B23N_TRIGOUT.3 T15_B23N_TRIGOUT.4 T15_B23N_TRIGOUT.5 VSLUE2.10(GND) VSLUE3.10(GND) VSLUE4.10(GND) VSLUE5.10(GND) VSLUE6.10(GND) VSLUE7.10(GND) VSLUE8.10(GND) VSLUE9.10(GND) VSLUE11.10(GND) VSLUE.10(GND)
GPIO_00_D3 [50ohm]: D3_CLKOUT_3P.1 J50.2 R51.P$2 SV1.2
GPIO_0_IN0_A8CLK [50ohm]: A8CLK_4N.1 J24.2 PIN_AIN_PWRGND21.10 R23.P$2 SV1.1
GPIO_0_IN1_B8CLK [50ohm]: B8CLK_4P.1 J23.2 PIN_AIN_PWRGND21.12 R22.P$2 SV1.3
GPIO_01_C3 [50ohm]: C3_CLKOUT_3N.1 J30.2 R27.P$2 SV1.4
GPIO_1_IN0_T9CLK [50ohm]: J6.2 R6.P$2 SV2.1 T9CLK_7N.1
GPIO_1_IN1_R9CLK_CLKIN [50ohm]: J5.2 PIN_ANALOG_21.1 R5.P$2 R9CLK_7P_CLKIN.1 SV2.3
GPIO_02_A2 [50ohm]: A2_T2N.1 J22.2 PIN_AIN_PWRGND21.14 R20.P$2 SV1.5
GPIO_2_IN0_E15CLK [50ohm]: E15CLK_2P.1 J1.2 J16.2 PIN_AIN_PWRGND21.4 R19.P$2
GPIO_2_IN1_E16CLK [50ohm]: E16CLK_2N.1 J1.3 J15.2 PIN_AIN_PWRGND21.2 R18.P$2
GPIO_2_IN2_M16CLK [50ohm]: J1.4 J141.2 M16CLK_3N.1 R15.P$2
GPIO_03_A3 [50ohm]: A3_T2P.1 J25.2 PIN_AIN_PWRGND21.13 R25.P$2 SV1.6
GPIO_04_B3 [50ohm]: OJ96.1 SV1.7 VSLUE11.6(1A3) VSLUE11.8(1A4)
GPIO_05_B4 [50ohm]: OJ94.1 SV1.8 VSLUE11.11(2A1) VSLUE11.13(2A2)
GPIO_06_A4 [50ohm]: OJ93.1 SV1.9 VSLUE11.15(2A3) VSLUE11.17(2A4)
GPIO_07_B5 [50ohm]: OJ71.1 SV1.10 VSLUE8.2(1A1) VSLUE8.4(1A2)
GPIO_08_A5 [50ohm]: OJ72.1 SV1.13 VSLUE8.6(1A3) VSLUE8.8(1A4)
GPIO_09_D5 [50ohm]: OJ69.1 SV1.14 VSLUE8.15(2A3) VSLUE8.17(2A4)
GPIO_010_B6 [50ohm]: OJ47.1 SV1.15 VSLUE5.2(1A1) VSLUE5.4(1A2)
GPIO_10_F13_SERIALIN [50ohm]: J3.2 PIN_ANALOG_21.11 SV2.2
GPIO_011_A6 [50ohm]: OJ48.1 SV1.16 VSLUE5.6(1A3) VSLUE5.8(1A4)
GPIO_11_T15_TRIGOUT [50ohm]: J40.2 PIN_ANALOG_21.7 R39.P$2 SV2.4 T15_B23N_TRIGOUT.1
GPIO_012_B7 [50ohm]: B7_T9P.1 J49.2 R50.P$2 SV1.17
GPIO_12_T14_SPARE [50ohm]: J4.2 PIN_ANALOG_21.3 R4.P$2 SV2.5 T14_B23P_SPARE.1
GPIO_013_D6 [50ohm]: OJ55.1 SV1.18 VSLUE6.2(1A1) VSLUE6.4(1A2)
GPIO_13_T13 [50ohm]: J38.2 PIN_AIN_PWRGND21.7 R32.P$2 SV2.6 T13_B20N.1
GPIO_014_A7 [50ohm]: A7_T9N.1 J35.2 R33.P$2 SV1.19
GPIO_14_R13 [50ohm]: J17.2 PIN_AIN_PWRGND21.5 R13_B20P.1 R161.P$2 SV2.7
GPIO_015_C6 [50ohm]: OJ56.1 SV1.20 VSLUE6.6(1A3) VSLUE6.8(1A4)
GPIO_15_T12 [50ohm]: J9.2 R100.P$2 SV2.8 T12_B18N.1
GPIO_016_C8 [50ohm]: OJ53.1 SV1.21 VSLUE6.15(2A3) VSLUE6.17(2A4)
GPIO_16_R12 [50ohm]: J10.2 R12_B18P.1 R111.P$2 SV2.9
GPIO_017_E6 [50ohm]: OJ54.1 SV1.22 VSLUE6.11(2A1) VSLUE6.13(2A2)
GPIO_17_T11_TRIGIN [50ohm]: J3.3 PIN_ANALOG_21.9 SV2.10
GPIO_018_E7 [50ohm]: OJ64.1 SV1.23 VSLUE7.6(1A3) VSLUE7.8(1A4)
GPIO_18_T10 [50ohm]: J51.2 R53.P$2 SV2.13 T10_B16N.1
GPIO_019_D8 [50ohm]: OJ21.1 SV1.24 VSLUE2.15(2A3) VSLUE2.17(2A4)
GPIO_19_R11_SERIALOUT [50ohm]: J3.1 PIN_ANALOG_21.13 SV2.14
GPIO_20_A14 [50ohm]: A14_CLKOUT_2N.1 J1.5 J31.2 R29.P$2
GPIO_020_E8 [50ohm]: E8_T10N.1 J41.2 R40.P$2 SV1.25
GPIO_21_B16 [50ohm]: J1.6 OJ22.1 VSLUE2.11(2A1) VSLUE2.13(2A2)
GPIO_021_F8 [50ohm]: F8_T10P.1 J18.2 R21.P$2 SV1.26
GPIO_22_C14 [50ohm]: J1.7 OJ32.1 VSLUE3.6(1A3) VSLUE3.8(1A4)
GPIO_022_F9 [50ohm]: OJ62.1 SV1.27 VSLUE7.11(2A1) VSLUE7.13(2A2)
GPIO_23_C16 [50ohm]: J1.8 OJ63.1 VSLUE7.2(1A1) VSLUE7.4(1A2)
GPIO_023_E9 [50ohm]: OJ24.1 SV1.28 VSLUE2.6(1A3) VSLUE2.8(1A4)
GPIO_024_C9 [50ohm]: C9_T15N.1 J8.2 PIN_ANALOG_21.4 R91.P$2 SV1.31
GPIO_24_C15 [50ohm]: J1.9 OJ31.1 VSLUE3.2(1A1) VSLUE3.4(1A2)
GPIO_025_D9 [50ohm]: D9_T15P.1 J11.2 PIN_ANALOG_21.6 R141.P$2 SV1.32
GPIO_25_D16 [50ohm]: J1.10 OJ39.1 VSLUE4.2(1A1) VSLUE4.4(1A2)
GPIO_26_D15 [50ohm]: J1.11 OJ29.1 VSLUE3.15(2A3) VSLUE3.17(2A4)
GPIO_026_E11 [50ohm]: OJ79.1 SV1.33 VSLUE9.2(1A1) VSLUE9.4(1A2)
GPIO_27_D14 [50ohm]: J1.12 OJ40.1 VSLUE4.6(1A3) VSLUE4.8(1A4)
GPIO_027_E10 [50ohm]: OJ5.1 SV1.34 VSLUE.15(2A3) VSLUE.17(2A4)
GPIO_028_C11 [50ohm]: OJ78.1 SV1.35 VSLUE9.11(2A1) VSLUE9.13(2A2)
GPIO_28_F15 [50ohm]: J1.13 OJ37.1 VSLUE4.15(2A3) VSLUE4.17(2A4)
GPIO_029_B11 [50ohm]: OJ6.1 SV1.36 VSLUE.11(2A1) VSLUE.13(2A2)
GPIO_29_F16 [50ohm]: J1.14 OJ38.1 VSLUE4.11(2A1) VSLUE4.13(2A2)
GPIO_030_A12 [50ohm]: A12_T21N.1 J36.2 R9.P$2 SV1.37
GPIO_031_D11 [50ohm]: OJ8.1 SV1.38 VSLUE.6(1A3) VSLUE.8(1A4)
GPIO_032_D12 [50ohm]: OJ95.1 SV1.39 VSLUE11.2(1A1) VSLUE11.4(1A2)
GPIO_033_B12 [50ohm]: B12_T21P.1 J37.2 R11.P$2 SV1.40
GPIO_110_P11 [50ohm]: OJ80.1 SV2.15 VSLUE9.6(1A3) VSLUE9.8(1A4)
GPIO_111_R10 [50ohm]: J48.2 R10_B16P.1 R49.P$2 SV2.16
GPIO_112_N12 [50ohm]: OJ23.1 SV2.17 VSLUE2.2(1A1) VSLUE2.4(1A2)
GPIO_113_P9 [50ohm]: OJ45.1 SV2.18 VSLUE5.15(2A3) VSLUE5.17(2A4)
GPIO_114_N9 [50ohm]: J3.4 LED1.A R17.1 SV2.19 VSLUE2.1(!1OE) VSLUE2.19(!2OE) VSLUE3.1(!1OE) VSLUE3.19(!2OE) VSLUE4.1(!1OE) VSLUE4.19(!2OE) VSLUE5.1(!1OE) VSLUE5.19(!2OE) VSLUE6.1(!1OE) VSLUE6.19(!2OE) VSLUE7.1(!1OE) VSLUE7.19(!2OE) VSLUE8.1(!1OE) VSLUE8.19(!2OE) VSLUE9.1(!1OE) VSLUE9.19(!2OE) VSLUE11.1(!1OE) VSLUE11.19(!2OE) VSLUE.1(!1OE) VSLUE.19(!2OE)
GPIO_115_N11 [50ohm]: OJ46.1 SV2.20 VSLUE5.11(2A1) VSLUE5.13(2A2)
GPIO_116_L16 [50ohm]: J32.2 L16_R11N.1 PIN_ANALOG_21.12 R28.P$2 SV2.21
GPIO_117_K16 [50ohm]: J33.2 K16_R10N.1 PIN_AIN_PWRGND21.3 R30.P$2 SV2.22
GPIO_118_R16 [50ohm]: J34.2 PIN_ANALOG_21.10 R16_R15P.1 R31.P$2 SV2.23
GPIO_119_L15 [50ohm]: J43.2 L15_R11P.1 PIN_ANALOG_21.14 R43.P$2 SV2.24
GPIO_120_P15 [50ohm]: OJ61.1 SV2.25 VSLUE7.15(2A3) VSLUE7.17(2A4)
GPIO_121_P16 [50ohm]: J42.2 P16_R15N.1 PIN_ANALOG_21.8 R41.P$2 SV2.26
GPIO_122_R14 [50ohm]: J53.2 R14_CLKOUT_4N.1 R46.P$2 SV2.27
GPIO_123_N16 [50ohm]: J55.2 N16_R13N.1 PIN_AIN_PWRGND21.6 R52.P$2 SV2.28
GPIO_124_N15 [50ohm]: J54.2 N15_R13P.1 PIN_AIN_PWRGND21.8 R47.P$2 SV2.31
GPIO_125_P14 [50ohm]: J52.2 P14_CLKOUT_4P.1 R45.P$2 SV2.32
GPIO_126_L14 [50ohm]: J7.2 SV2.33
GPIO_127_N14 [50ohm]: OJ70.1 SV2.34 VSLUE8.11(2A1) VSLUE8.13(2A2)
GPIO_128_M10 [50ohm]: J12.2 SV2.35
GPIO_129_L13 [50ohm]: J7.1 SV2.36
GPIO_130_J16 [50ohm]: J12.1 SV2.37
GPIO_131_K15 [50ohm]: J39.2 K15_R10P.1 PIN_AIN_PWRGND21.1 R35.P$2 SV2.38
GPIO_132_J13 [50ohm]: OJ77.1 SV2.39 VSLUE9.15(2A3) VSLUE9.17(2A4)
GPIO_133_J14 [50ohm]: OJ7.1 SV2.40 VSLUE.2(1A1) VSLUE.4(1A2)
GPIO_210_F14 [50ohm]: J1.15 OJ30.1 VSLUE3.11(2A1) VSLUE3.13(2A2)
GPIO_211_G16 [50ohm]: G16_R5N.1 J1.16 J28.2 PIN_AIN_PWRGND21.11 R24.P$2
GPIO_212_G15 [50ohm]: G15_R5P.1 J1.17 J29.2 PIN_AIN_PWRGND21.9 R26.P$2
LED1R [power]: LED1.C R8.1
OUT1 [50ohm]: J14.1 OJ1.1 VSLUE.16(1Y2) VSLUE.18(1Y1)
OUT2 [50ohm]: D11.1 OJ2.1 VSLUE.12(1Y4) VSLUE.14(1Y3)
OUT3 [50ohm]: B11.1 OJ3.1 VSLUE.7(2Y2) VSLUE.9(2Y1)
OUT4 [50ohm]: E10.1 OJ4.1 VSLUE.3(2Y4) VSLUE.5(2Y3)
OUT9 [50ohm]: N12.1 OJ20.1 VSLUE2.16(1Y2) VSLUE2.18(1Y1)
OUT10 [50ohm]: E9.1 OJ19.1 VSLUE2.12(1Y4) VSLUE2.14(1Y3)
OUT11 [50ohm]: D8.1 OJ17.1 VSLUE2.3(2Y4) VSLUE2.5(2Y3)
OUT12 [50ohm]: B16.1 OJ18.1 VSLUE2.7(2Y2) VSLUE2.9(2Y1)
OUT13 [50ohm]: C15.1 OJ28.1 VSLUE3.16(1Y2) VSLUE3.18(1Y1)
OUT14 [50ohm]: C14.1 OJ27.1 VSLUE3.12(1Y4) VSLUE3.14(1Y3)
OUT15 [50ohm]: D15.1 OJ25.1 VSLUE3.3(2Y4) VSLUE3.5(2Y3)
OUT16 [50ohm]: F14.1 OJ26.1 VSLUE3.7(2Y2) VSLUE3.9(2Y1)
OUT17 [50ohm]: D16.1 OJ36.1 VSLUE4.16(1Y2) VSLUE4.18(1Y1)
OUT18 [50ohm]: D14.1 OJ35.1 VSLUE4.12(1Y4) VSLUE4.14(1Y3)
OUT19 [50ohm]: F15.1 OJ33.1 VSLUE4.3(2Y4) VSLUE4.5(2Y3)
OUT20 [50ohm]: F16.1 OJ34.1 VSLUE4.7(2Y2) VSLUE4.9(2Y1)
OUT21 [50ohm]: B6.1 OJ44.1 VSLUE5.16(1Y2) VSLUE5.18(1Y1)
OUT22 [50ohm]: A6.1 OJ43.1 VSLUE5.12(1Y4) VSLUE5.14(1Y3)
OUT23 [50ohm]: OJ41.1 P9.1 VSLUE5.3(2Y4) VSLUE5.5(2Y3)
OUT24 [50ohm]: N11.1 OJ42.1 VSLUE5.7(2Y2) VSLUE5.9(2Y1)
OUT25 [50ohm]: D6.1 OJ52.1 VSLUE6.16(1Y2) VSLUE6.18(1Y1)
OUT26 [50ohm]: C6.1 OJ51.1 VSLUE6.12(1Y4) VSLUE6.14(1Y3)
OUT27 [50ohm]: C8.1 OJ49.1 VSLUE6.3(2Y4) VSLUE6.5(2Y3)
OUT28 [50ohm]: E6.1 OJ50.1 VSLUE6.7(2Y2) VSLUE6.9(2Y1)
OUT29 [50ohm]: C16.1 OJ60.1 VSLUE7.16(1Y2) VSLUE7.18(1Y1)
OUT30 [50ohm]: E7.1 OJ59.1 VSLUE7.12(1Y4) VSLUE7.14(1Y3)
OUT31 [50ohm]: OJ57.1 P15.1 VSLUE7.3(2Y4) VSLUE7.5(2Y3)
OUT32 [50ohm]: F9.1 OJ58.1 VSLUE7.7(2Y2) VSLUE7.9(2Y1)
OUT33 [50ohm]: B5.1 OJ68.1 VSLUE8.16(1Y2) VSLUE8.18(1Y1)
OUT34 [50ohm]: A5.1 OJ67.1 VSLUE8.12(1Y4) VSLUE8.14(1Y3)
OUT35 [50ohm]: D5.1 OJ65.1 VSLUE8.3(2Y4) VSLUE8.5(2Y3)
OUT36 [50ohm]: N14.1 OJ66.1 VSLUE8.7(2Y2) VSLUE8.9(2Y1)
OUT37 [50ohm]: E11.1 OJ76.1 VSLUE9.16(1Y2) VSLUE9.18(1Y1)
OUT38 [50ohm]: OJ75.1 P11.1 VSLUE9.12(1Y4) VSLUE9.14(1Y3)
OUT39 [50ohm]: J13.1 OJ73.1 VSLUE9.3(2Y4) VSLUE9.5(2Y3)
OUT40 [50ohm]: C11.1 OJ74.1 VSLUE9.7(2Y2) VSLUE9.9(2Y1)
OUT45 [50ohm]: D12.1 OJ92.1 VSLUE11.16(1Y2) VSLUE11.18(1Y1)
OUT46 [50ohm]: B3.1 OJ91.1 VSLUE11.12(1Y4) VSLUE11.14(1Y3)
OUT47 [50ohm]: A4.1 OJ89.1 VSLUE11.3(2Y4) VSLUE11.5(2Y3)
OUT48 [50ohm]: B4.1 OJ90.1 VSLUE11.7(2Y2) VSLUE11.9(2Y1)
Unconnected: J2.1 J2.2 J2.3 J2.4 J2.5 J2.6 J2.7 J2.8 J2.9 J2.10 J2.11 J2.12 J2.13 J2.14 J2.15 J2.16 J2.17 J2.18 J2.19 J2.20 J2.21 J2.22 J2.23 J2.24 J2.25 J2.26

## Notes on the sheet
- Top pins
- Bottom pins

## Library data of the parts
A2_T2N A3_T2P A4-A6 A7_T9N A8CLK_4N A12_T21N A14_CLKOUT_2N B3-B6 B7_T9P B8CLK_4P B11 B12_T21P B16 C3_CLKOUT_3N C6 C8 C9_T15N C11 C14-C16 D3_CLKOUT_3P D5 D6 D8 D9_T15P D11 D12 D14-D16 E6 E7 E8_T10N E9-E11 E15CLK_2P E16CLK_2N F8_T10P F9 F14-F16 G15_R5P G16_R5N J13 J14 K15_R10P K16_R10N L15_R11P L16_R11N M16CLK_3N N11 N12 N14 N15_R13P N16_R13N P9 P11 P14_CLKOUT_4P P15 P16_R15N R9CLK_7P_CLKIN R10_B16P R12_B18P R13_B20P R14_CLKOUT_4N R16_R15P T9CLK_7N T10_B16N T12_B18N T13_B20N T14_B23P_SPARE T15_B23N_TRIGOUT = con-coax:BU-SMB-V: FEMALE SMB CONNECTOR Radiall distributor RS 112-2993; OC_FARNELL: unknown; OC_NEWARK: unknown
C2 C4 C5 C10 C91 C93-C97 = SparkFun-Capacitors:CAP: Capacitor Standard 0603 ceramic capacitor, and 0.1" leaded capacitor.
J1 J2 = SparkFun-Connectors:M13X2: 0.1" spaced headers
J3 J7 J12 J131 J311 = Seeed-Connector:DIP-BLACK-FEMALE-HEADER-VERT(4P-2.54): 320030017; MPN: F185-1104A1BSYA1
J4-J6 J8-J11 J15-J18 J22-J25 J28-J43 J48-J55 J141 OJ1-OJ8 OJ17-OJ80 OJ89-OJ96 = Seeed-Connector:DIP-BLACK-MALE-HEADER-VERT(2P-2.54): 320020016; MPN: P125-1102A0BS116A1
LED1 = led:LED: LED OSRAM: - CHIPLED LG R971, LG N971, LY N971, LG Q971, LY Q971, LO R971, LY R971 LH N974, LH R974 LS Q976, LO Q976, LY Q976 LO Q996 - Hyper CHIPLED LW Q18S LB Q993, LB Q99A, LB R99A - SideLED LS A670, LO A670, LY A670, LG A670, LP A670 LB A673, LV A673, LT A673, LW A673 LH A674 LY A675 LS A676, LA A676, LO A676, LY A676, LW A676 LS A679, LY A679, LG A679 - Hyper Micro SIDELED® LS Y876, LA Y876, LO Y876, LY Y876 LT Y87S - SmartLED LW L88C, LW L88S LB L89C, LB L89S, LG L890 LS L89K, LO L89K, LY L89K LS L896, LA L896, LO L896, LY L896 - TOPLED LS T670, LO T670, LY T670, LG T670, LP T670 LSG T670, LSP T670, LSY T670, LOP T670, LYG T670 LG T671, LOG T671, LSG T671 LB T673, LV T673, LT T673, LW T673 LH T674 LS T676, LA T676, LO T676, LY T676, LB T676, LH T676, LSB T676, LW T676 LB T67C, LV T67C, LT T67C, LS T67K, LO T67K, LY T67K, LW E67C LS E67B, LA E67B, LO E67B, LY E67B, LB E67C, LV E67C, LT E67C LW T67C LS T679, LY T679, LG T679 LS T770, LO T770, LY T770, LG T770, LP T770 LB T773, LV T773, LT T773, LW T773 LH T774 LS E675, LA E675, LY E675, LS T675 LS T776, LA T776, LO T776, LY T776, LB T776 LHGB T686 LT T68C, LB T68C - Hyper Mini TOPLED® LB M676 - Mini TOPLED Santana® LG M470 LS M47K, LO M47K, LY M47K Source: http://www.osram.convergy.de LUXEON: - LUMILED® LXK2-PW12-R00, LXK2-PW12-S00, LXK2-PW14-U00, LXK2-PW14-V00 LXK2-PM12-R00, LXK2-PM12-S00, LXK2-PM14-U00 LXK2-PE12-Q00, LXK2-PE12-R00, LXK2-PE12-S00, LXK2-PE14-T00, LXK2-PE14-U00 LXK2-PB12-K00, LXK2-PB12-L00, LXK2-PB12-M00, LXK2-PB14-N00, LXK2-PB14-P00, LXK2-PB14-Q00 LXK2-PR12-L00, LXK2-PR12-M00, LXK2-PR14-Q00, LXK2-PR14-R00 LXK2-PD12-Q00, LXK2-PD12-R00, LXK2-PD12-S00 LXK2-PH12-R00, LXK2-PH12-S00 LXK2-PL12-P00, LXK2-PL12-Q00, LXK2-PL12-R00 Source: www.luxeon.com KINGBRIGHT: KA-3528ASYC Source: www.kingbright.com
PIN_AIN_PWRGND21 PIN_ANALOG_21 = pinhead:PINHD-2X8: PIN HEADER; MPN: 15-91-2160
R4-R6 R9 R11 R15 R18-R33 R35 R39-R41 R43 R45-R47 R49-R53 R91 R100 R111 R141 R161 = SparkFun-Passives:RESISTOR: Resistor Basic schematic elements and footprints for 0603, 1206, and PTH resistors.
R8 R17 = resistor:R-US_: RESISTOR, American symbol
SV1 SV2 = con-lsta:FE20-2: FEMALE HEADER; OC_FARNELL: unknown; OC_NEWARK: unknown
VSLUE VSLUE2-VSLUE9 VSLUE11 = SN74ACT244DW:SN74ACT244DW: SN74ACT244DW, 8-Bit Buffer, Line Driver, ACT, 3-State Non-Inverting 4.5 5.5 V 20-Pin SOIC Source: Datasheet <http://www.ti.com/lit/ds/symlink/sn74act244.pdf>; ARROW_PART_NUMBER: SN74ACT244DW; ARROW_PRICE-STOCK: https://www.arrow.com/en/products/sn74act244dw/texas-instruments; DESCRIPTION: SN74ACT244DW, 8-Bit Buffer, Line Driver, ACT, 3-State Non-Inverting 4.5 5.5 V 20-Pin SOIC; HEIGHT: 2.65mm; MANUFACTURER_NAME: Texas Instruments; MANUFACTURER_PART_NUMBER: SN74ACT244DW; RS_PART_NUMBER: 4363169; RS_PRICE-STOCK: http://uk.rs-online.com/web/p/products/4363169

## Net classes
0 default: width 0.254 mm
1 power: width 0.762 mm
3 five: width 0.381 mm
4 50ohm: width 0.254 mm, clearance 0.254 mm to class 0, clearance 0.254 mm to class 1, clearance 0.254 mm to class 2, clearance 0.254 mm to class 3, clearance 0.254 mm